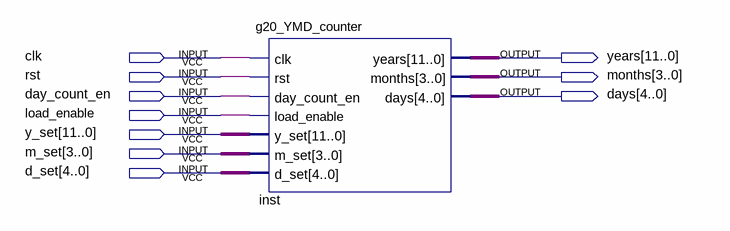
[diagram p0: schematic sheet]
// Quartus schematic g20_YMD_Counter.bdf as structural Verilog: 1 symbols, 10 pins
module g20_YMD_Counter (
  input  clk,
  input  rst,
  input  day_count_en,
  input  load_enable,
  input  [11:0] y_set,
  input  [3:0] m_set,
  input  [4:0] d_set,
  output [11:0] years,
  output [3:0] months,
  output [4:0] days
);

  g20_YMD_counter inst (
    .clk(clk), .rst(rst), .day_count_en(day_count_en), .load_enable(load_enable), .y_set(y_set),
    .m_set(m_set), .d_set(d_set), .years(years), .months(months), .days(days));
endmodule
